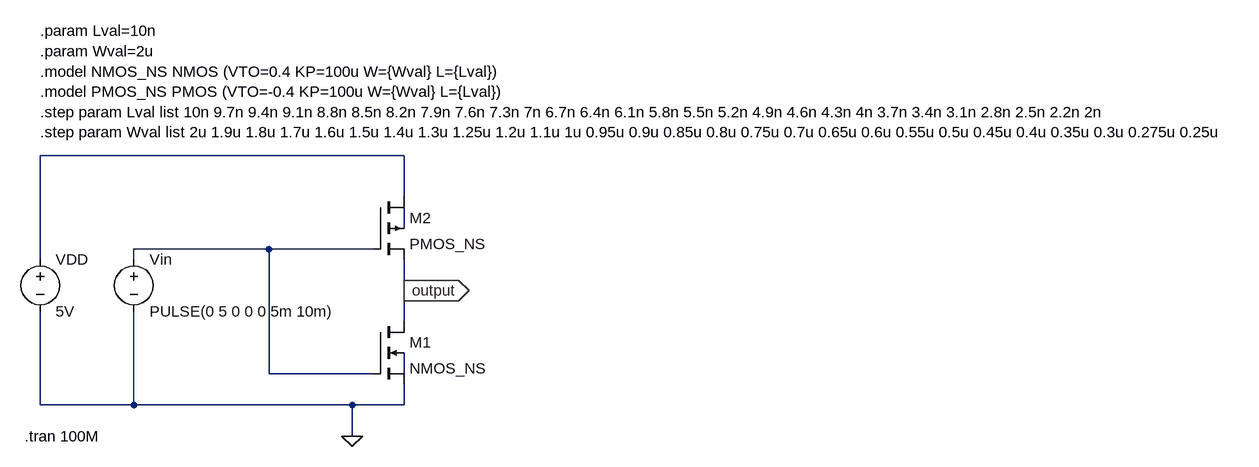
[diagram p0: schematic nanosheet_circuit.asc]
nanosheet_circuit.asc, the LTspice schematic file:
Version 4
SHEET 1 1716 872
WIRE 288 352 -272 352
WIRE 288 416 288 352
WIRE 288 464 288 432
WIRE 80 496 -128 496
WIRE 240 496 80 496
WIRE -272 512 -272 352
WIRE -128 512 -128 496
WIRE 288 560 288 512
WIRE 288 608 288 560
WIRE 80 688 80 496
WIRE 240 688 80 688
WIRE 288 688 288 656
WIRE -272 736 -272 592
WIRE -128 736 -128 592
WIRE -128 736 -272 736
WIRE 208 736 -128 736
WIRE 288 736 288 704
WIRE 288 736 208 736
WIRE 208 784 208 736
FLAG 208 784 0
FLAG 288 560 output
IOPIN 288 560 Out
SYMBOL voltage -272 496 R0
SYMATTR InstName VDD
SYMATTR Value 5V
SYMBOL voltage -128 496 R0
WINDOW 123 0 0 Left 0
WINDOW 39 0 0 Left 0
SYMATTR InstName Vin
SYMATTR Value PULSE(0 5 0 0 0 5m 10m)
SYMBOL nmos4 240 608 R0
SYMATTR InstName M1
SYMATTR Value NMOS_NS
SYMBOL pmos4 240 416 R0
SYMATTR InstName M2
SYMATTR Value PMOS_NS
TEXT -272 160 Left 2 !.param Lval=10n\n.param Wval=2u\n.model NMOS_NS NMOS (VTO=0.4 KP=100u W={Wval} L={Lval})\n.model PMOS_NS PMOS (VTO=-0.4 KP=100u W={Wval} L={Lval})\n.step param Lval list 10n 9.7n 9.4n 9.1n 8.8n 8.5n 8.2n 7.9n 7.6n 7.3n 7n 6.7n 6.4n 6.1n 5.8n 5.5n 5.2n 4.9n 4.6n 4.3n 4n 3.7n 3.4n 3.1n 2.8n 2.5n 2.2n 2n\n.step param Wval list 2u 1.9u 1.8u 1.7u 1.6u 1.5u 1.4u 1.3u 1.25u 1.2u 1.1u 1u 0.95u 0.9u 0.85u 0.8u 0.75u 0.7u 0.65u 0.6u 0.55u 0.5u 0.45u 0.4u 0.35u 0.3u 0.275u 0.25u
TEXT -296 784 Left 2 !.tran 100M

The netlist it stands for:
* nanosheet_circuit.asc
VDD N001 0 5V
Vin N003 0 PULSE(0 5 0 0 0 5m 10m)
M1 output N003 0 N004 NMOS_NS
M2 N001 N003 output N002 PMOS_NS
.model NMOS NMOS
.model PMOS PMOS
.lib standard.mos
.param Lval=10n
.param Wval=2u
.model NMOS_NS NMOS (VTO=0.4 KP=100u W={Wval} L={Lval})
.model PMOS_NS PMOS (VTO=-0.4 KP=100u W={Wval} L={Lval})
.step param Lval list 10n 9.7n 9.4n 9.1n 8.8n 8.5n 8.2n 7.9n 7.6n 7.3n 7n 6.7n 6.4n 6.1n 5.8n 5.5n 5.2n 4.9n 4.6n 4.3n 4n 3.7n 3.4n 3.1n 2.8n 2.5n 2.2n 2n
.step param Wval list 2u 1.9u 1.8u 1.7u 1.6u 1.5u 1.4u 1.3u 1.25u 1.2u 1.1u 1u 0.95u 0.9u 0.85u 0.8u 0.75u 0.7u 0.65u 0.6u 0.55u 0.5u 0.45u 0.4u 0.35u 0.3u 0.275u 0.25u
.tran 100M
.backanno
.end